# EAGLE design EZS (EAGLE 8.0.1)
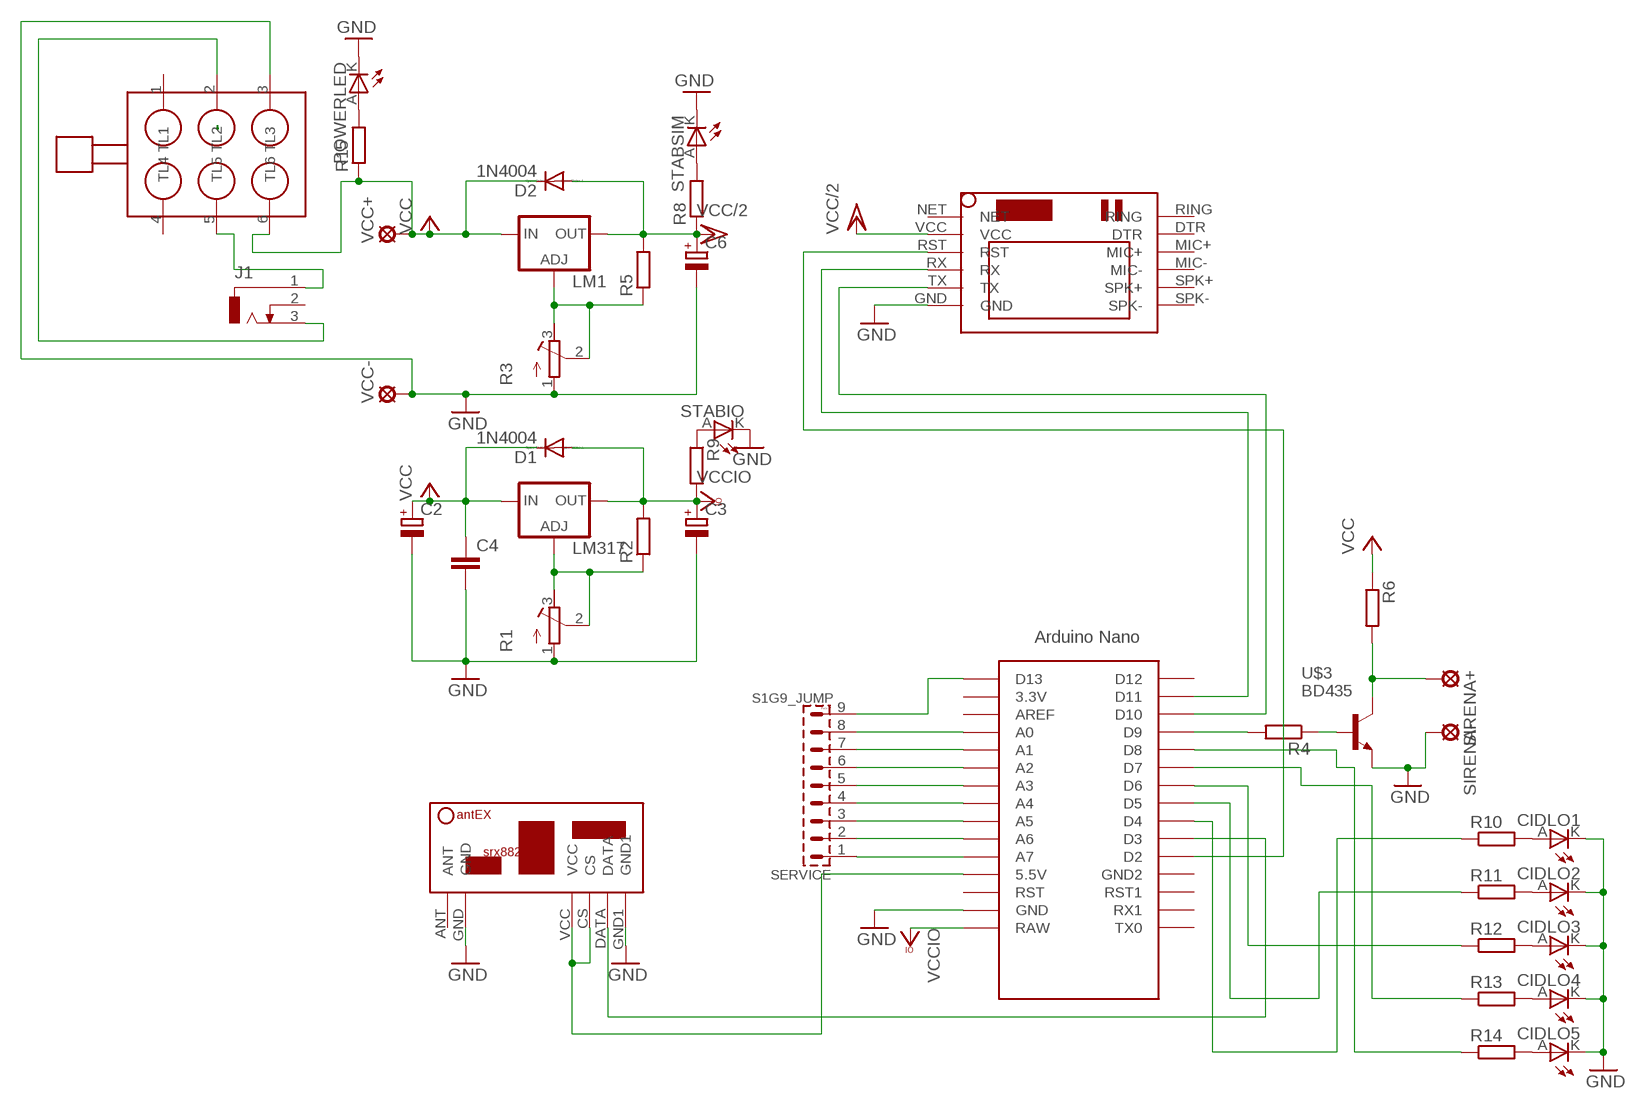
[diagram p0: schematic, sheet 1]

## Parts
C2  CPOL-EUE3.5-8  [E3,5-8]
C3  CPOL-EUE3.5-8  [E3,5-8]
C4  C-EU102-064X133  [C102-064X133]
C6  CPOL-EUE3.5-8  [E3,5-8]
CIDLO1  LEDLED3MM  [LED3MM]
CIDLO2  LEDLED3MM  [LED3MM]
CIDLO3  LEDLED3MM  [LED3MM]
CIDLO4  LEDLED3MM  [LED3MM]
CIDLO5  LEDLED3MM  [LED3MM]
D1  1N4004  [DO41-10]
D2  1N4004  [DO41-10]
J1  DCJ0303  [DCJ0303]
LM1  LM317TS  [317TS]
LM317  LM317TS  [317TS]
POWERLED  LEDLED3MM  [LED3MM]
R1  R-TRIMM64Y  [RTRIM64Y]
R2  R-EU_0207/10  [0207/10]
R3  R-TRIMM64Y  [RTRIM64Y]
R4  R-EU_0207/10  [0207/10]
R5  R-EU_0207/10  [0207/10]
R6  R-EU_0207/10  [0207/10]
R8  R-EU_0207/10  [0207/10]
R9  R-EU_0207/10  [0207/10]
R10  R-EU_0207/10  [0207/10]
R11  R-EU_0207/10  [0207/10]
R12  R-EU_0207/10  [0207/10]
R13  R-EU_0207/10  [0207/10]
R14  R-EU_0207/10  [0207/10]
R15  R-EU_0207/10  [0207/10]
SERVICE  S1G9_JUMP  [S1G9_JUM]
SIM800L  SIM800LMODULE  [SIM800LMODULE]
SIRENA+  LSP11  [LSP11]
SIRENA-  LSP11  [LSP11]
STABIO  LEDLED3MM  [LED3MM]
STABSIM  LEDLED3MM  [LED3MM]
U$1  NANO  [NANO]
U$2  RSX882  [SRX882]
U$3  BD435  [BD435]
U$4  TLACITKO  [TLACITKO]
VCC+  LSP11  [LSP11]
VCC-  LSP11  [LSP11]

## Nets
GND: C2.- C3.- C4.2 C6.- CIDLO1.K(C) CIDLO2.K(C) CIDLO3.K(C) CIDLO4.K(C) CIDLO5.K(C) POWERLED.K(C) R1.1(A) R3.1(A) SIM800L.GND SIRENA-.MP STABIO.K(C) STABSIM.K(C) U$1.GND U$2.GND U$2.GND1 U$3.E U$4.3(TL3) VCC-.MP
N$1: U$1.D3 U$2.DATA
N$2: LM317.1(ADJ) R1.2(S) R1.3(E) R2.1
N$3: U$1.5V(5.5V) U$2.CS U$2.VCC
N$4: R8.2 STABSIM.A
N$5: SIM800L.RX U$1.D11
N$6: LM1.1(ADJ) R3.2(S) R3.3(E) R5.1
N$7: SIM800L.TX U$1.D10
N$8: R4.2 U$1.D9
N$9: R4.1 U$3.B
N$10: R6.2 SIRENA+.MP U$3.C
N$11: J1.1 U$4.5(TL5)
N$12: J1.3 U$4.2(TL2)
N$13: POWERLED.A R15.2
N$15: SIM800L.RST U$1.D2
N$16: CIDLO1.A R10.2
N$17: CIDLO2.A R11.2
N$18: CIDLO3.A R12.2
N$19: CIDLO4.A R13.2
N$20: CIDLO5.A R14.2
N$21: R13.1 U$1.D7
N$22: R10.1 U$1.D4
N$24: R12.1 U$1.D6
N$25: SERVICE.1 U$1.A7
N$27: R9.1 STABIO.A
N$28: R11.1 U$1.D5
N$29: R14.1 U$1.D8
N$30: SERVICE.2 U$1.A6
N$31: SERVICE.3 U$1.A5
N$32: SERVICE.4 U$1.A4
N$33: SERVICE.5 U$1.A3
N$34: SERVICE.6 U$1.A2
N$35: SERVICE.7 U$1.A1
N$36: SERVICE.8 U$1.A0
N$37: SERVICE.9 U$1.D13
VCC: C2.+ C4.1 D1.C D2.C LM1.3(IN) LM317.3(IN) R6.1 R15.1 U$4.6(TL6) VCC+.MP
VCC/2: C6.+ D2.A LM1.2(OUT) R5.2 R8.1 SIM800L.VCC
VCCIO: C3.+ D1.A LM317.2(OUT) R2.2 R9.2 U$1.RAW
Unconnected: J1.2 SIM800L.DTR SIM800L.MIC+ SIM800L.MIC- SIM800L.NET SIM800L.RING SIM800L.SPK+ SIM800L.SPK- U$1.3.3V U$1.AREF U$1.D12 U$1.GND1(GND2) U$1.ICSP1 U$1.ICSP2 U$1.ICSP3 U$1.ICSP4 U$1.ICSP5 U$1.ICSP6 U$1.RST U$1.RST1 U$1.RX1 U$1.TX0 U$2.ANT U$4.1(TL1) U$4.4(TL4)

## Library data of the parts
C2 C3 C6 = rcl:CPOL-EU: POLARIZED CAPACITOR, European symbol
C4 = rcl:C-EU: CAPACITOR, European symbol
CIDLO1-CIDLO5 POWERLED STABIO STABSIM = #Led:LED
D1 D2 = diode:1N4004: DIODE general purpose rectifier, 1 A
J1 = con-jack:DCJ0303: DC POWER JACK Source: DCJ0303.pdf; OC_FARNELL: unknown; OC_NEWARK: unknown
LM1 LM317 = v-reg:LM317TS: VOLTAGE REGULATOR
R1 R3 = rcl:R-TRIMM: Trimm resistor
R2 R4-R6 R8-R15 = #Odpory:R-EU_: RESISTOR, European symbol
SERVICE = #PaJa_konektory:S1G9_JUMP: Radove konektory - koliky - 9x
SIM800L = SIM800LMODULE:SIM800LMODULE: SIM800L Module
SIRENA+ SIRENA- VCC+ VCC- = solpad:LSP11: SOLDER PAD drill 1.1 mm
U$1 = Arduino-clone:NANO: Arduino Nano
U$2 = SRX882:RSX882: SRX882 - přijímač 433MHz
U$3 = #BD435:BD435
U$4 = #Tlacitka:TLACITKO: Tlačítko ON/ON

## Board
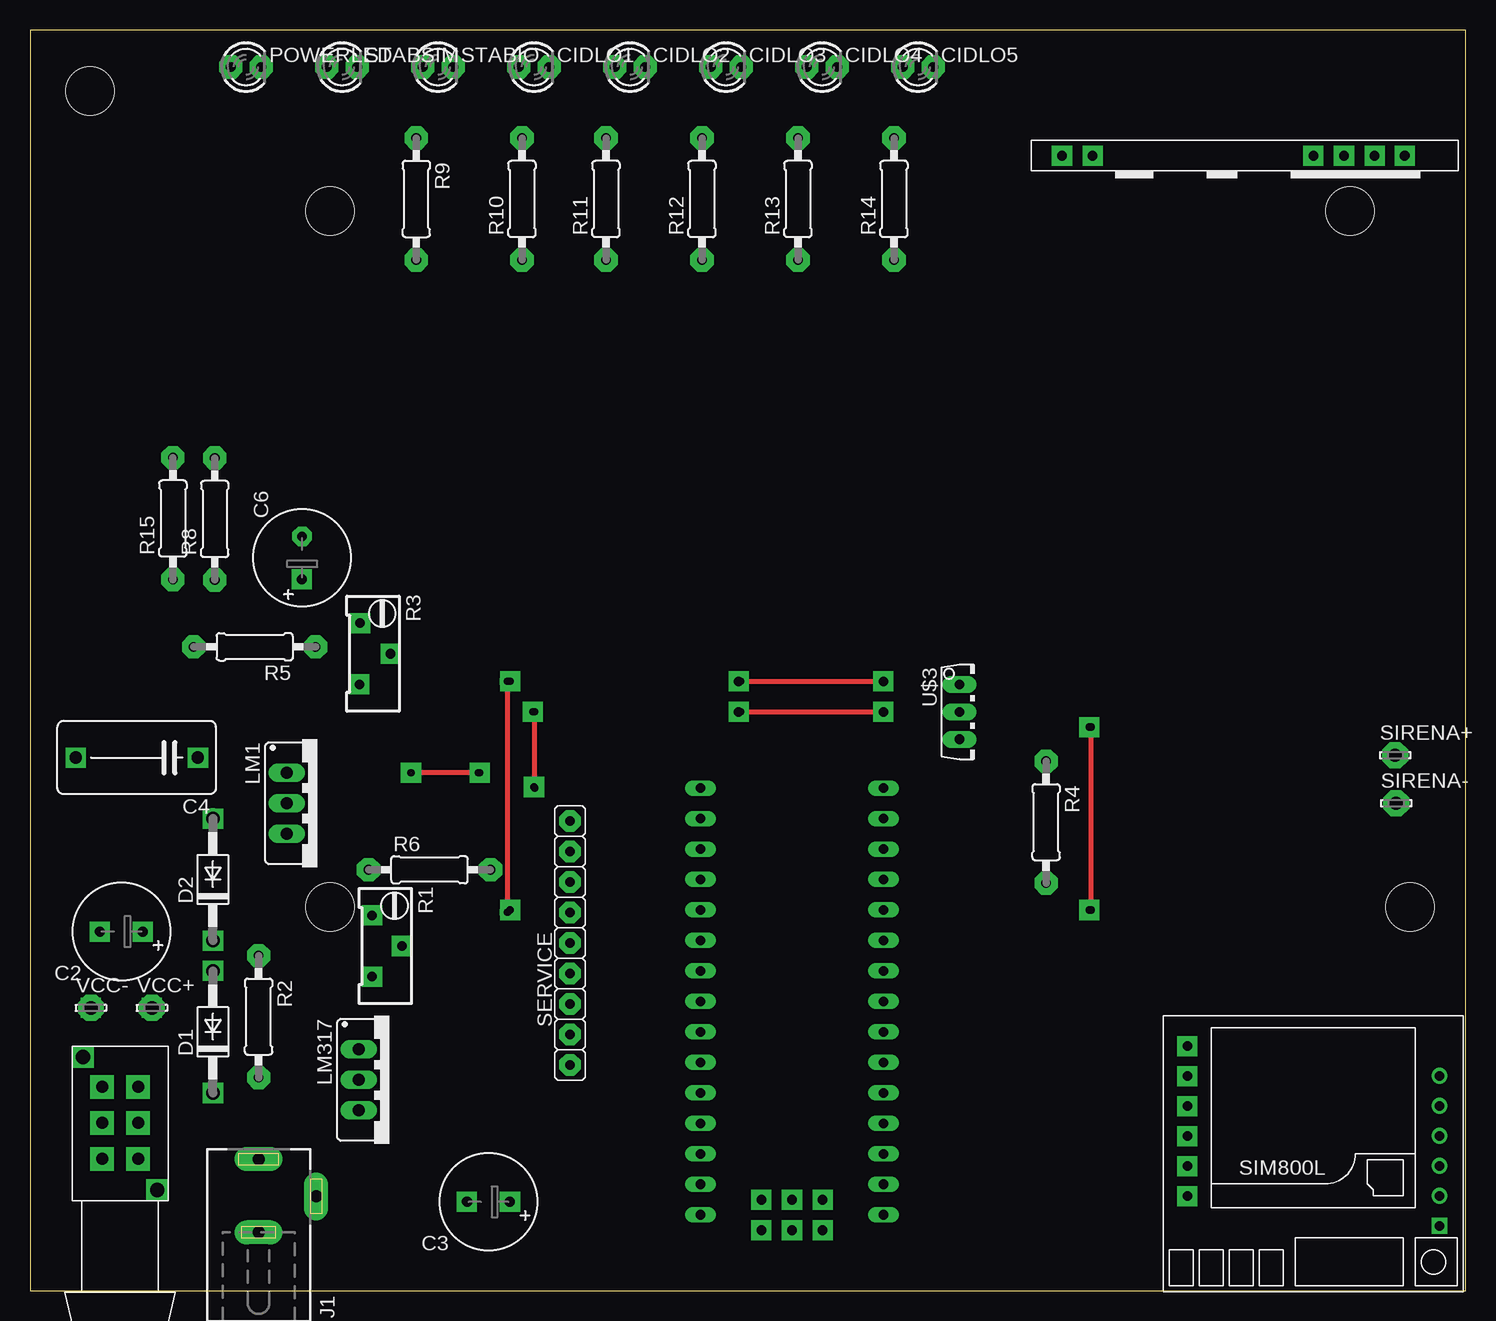
[diagram p1: board, top side]
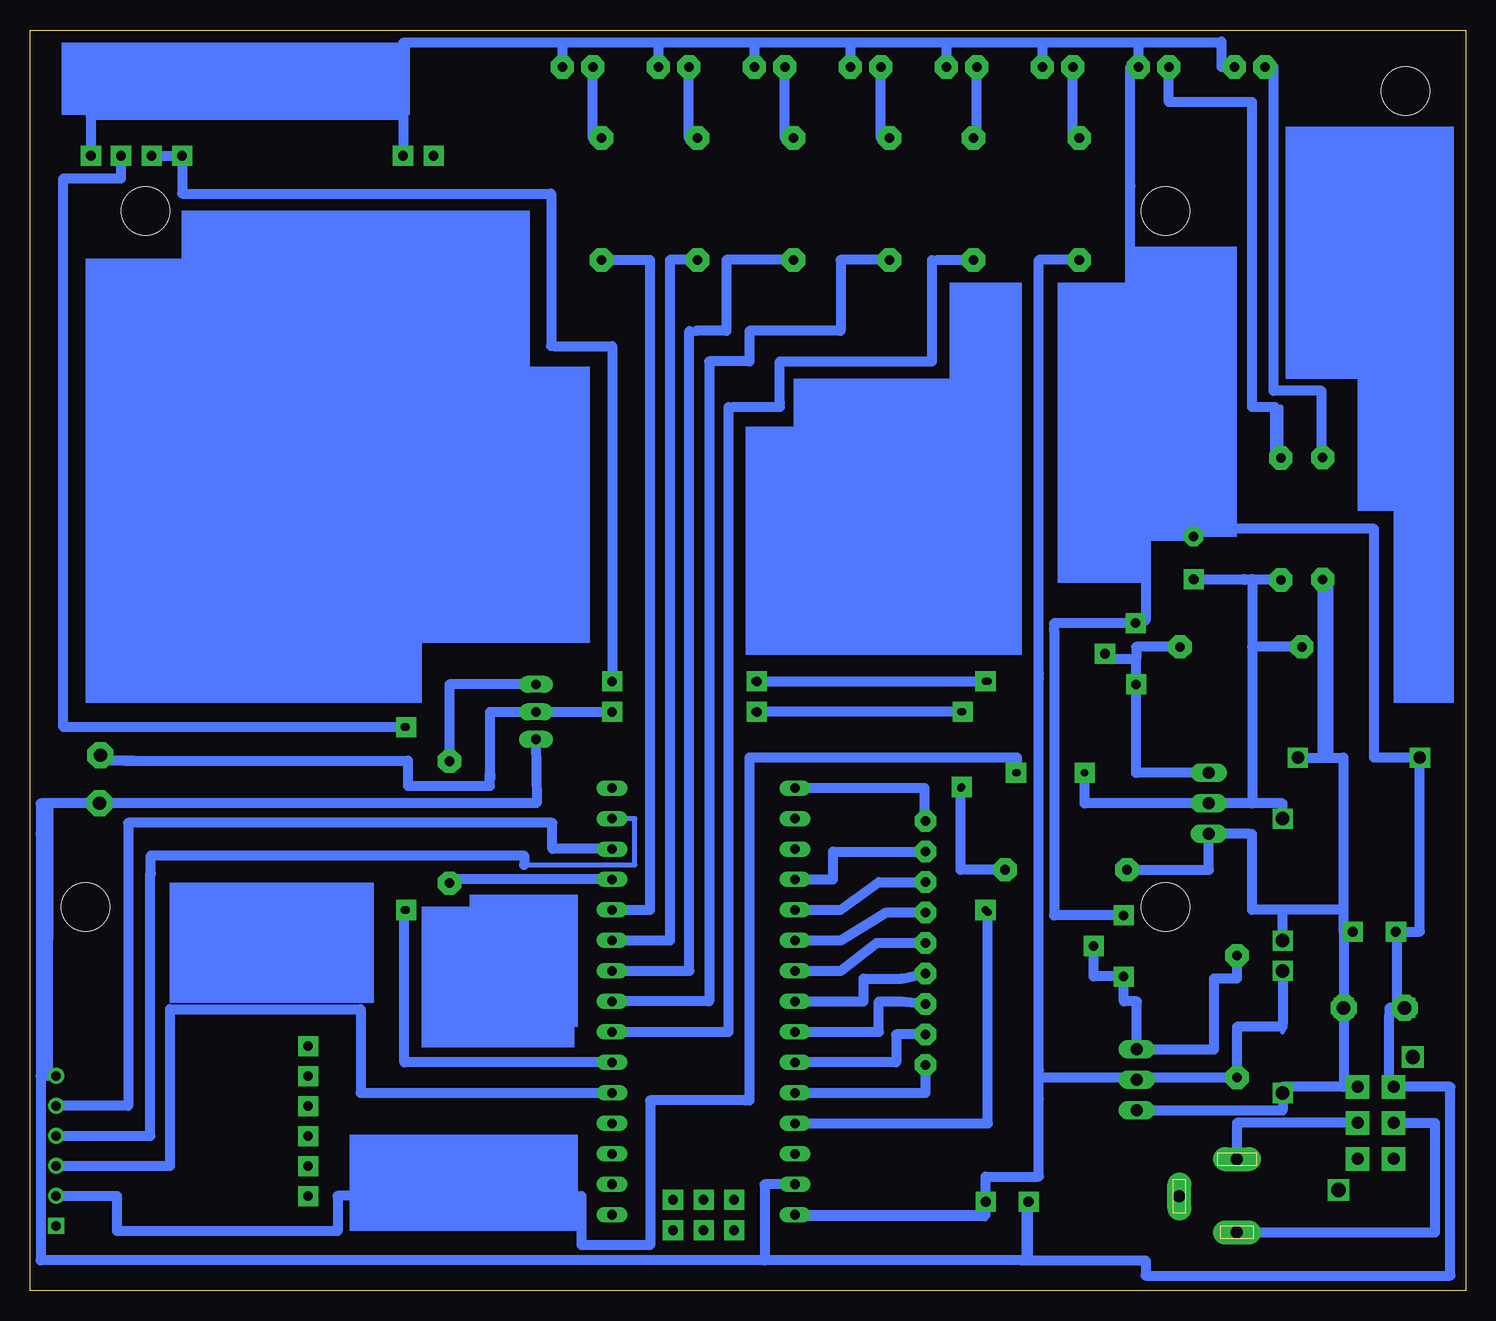
[diagram p2: board, bottom side, seen from below]

Size 119.63 x 105.08 mm. Coordinates in mm from the lower left corner, seen from the top.
Outline: 0,0 119.63,0 119.63,105.08 0,105.08 0,0
Copper layers (1*16): Top 0.035mm / dielectric 1.5mm / Bottom 0.035mm
Design rules "default": minimum track width 10mil, minimum drill 24mil, track to track 8mil, track to pad 8mil, pad to pad 8mil, via to via 8mil, smd to smd 8mil, copper to edge 40mil, drill to drill 8mil, minimum pad ring 10mil, minimum via ring 8mil, stop-mask expansion 4mil, vias tented up to drill 0mil, thermal gap 10mil
Holes 4 mm at 25,32 115,32 25,90 5,100 110,90

### Footprints (pad centres in the part's own frame; a part is rotated, then mirrored left to right if it is on the bottom)
E3,5-8 = drill 0.813 pad 1.6: + -1.778,0 | drill 0.813 pad 1.6 octagon: - 1.778,0
C102-064X133 = drill 1.016 octagon: 1 -5.08,0; 2 5.08,0
LED3MM = drill 0.8 pad 1.93 octagon: A -1.27,0; K 1.27,0
DO41-10 = drill 1.118: A 5.08,0; C -5.08,0
DCJ0303 = drill 1 pad 2 long: 1 0,3.1; 2 4.8,0; 3 0,-3
317TS = drill 1.016 long: 1 -2.54,-2.54; 2 0,-2.54; 3 2.54,-2.54
RTRIM64Y = drill 0.61: 1 0,-2.54; 2 -2.54,0; 3 0,2.54
0207/10 = drill 0.8 pad 1.93 octagon: 1 -5.08,0; 2 5.08,0
S1G9_JUM = drill 0.813 pad 1.778 octagon: 1 -10.16,0; 2 -7.62,0; 3 -5.08,0; 4 -2.54,0; 5 0,0; 6 2.54,0; 7 5.08,0; 8 7.62,0; 9 10.16,0
SIM800LMODULE = drill 0.8: DTR 10.5,1; GND -10.5,-6.5; MIC+ 10.5,-1.5; MIC- 10.5,-4; RST -10.5,1; RX -10.5,-1.5; SPK+ 10.5,-6.5; SPK- 10.5,-9; TX -10.5,-4; VCC -10.5,3.5 | drill 0.8 square: NET -10.5,6; RING 10.5,3.5
LSP11 = drill 1.118 pad 2.159 octagon: MP 0,0
NANO = drill 0.8 long: 3.3V -10.16,24.13; 5V -10.16,-1.27; A0 -10.16,19.05; A1 -10.16,16.51; A2 -10.16,13.97; A3 -10.16,11.43; A4 -10.16,8.89; A5 -10.16,6.35; A6 -10.16,3.81; A7 -10.16,1.27; AREF -10.16,21.59; D2 5.08,1.27; D3 5.08,3.81; D4 5.08,6.35; D5 5.08,8.89; D6 5.08,11.43; D7 5.08,13.97; D8 5.08,16.51; D9 5.08,19.05; D10 5.08,21.59; D11 5.08,24.13; D12 5.08,26.67; D13 -10.16,26.67; GND -10.16,-6.35; GND1 5.08,-1.27; RAW -10.16,-8.89; RST -10.16,-3.81; RST1 5.08,-3.81; RX1 5.08,-6.35; TX0 5.08,-8.89 | drill 0.8: ICSP1 -5.08,-10.16; ICSP2 -5.08,-7.62; ICSP3 -2.54,-10.16; ICSP4 -2.54,-7.62; ICSP5 0,-10.16; ICSP6 0,-7.62
SRX882 = drill 0.8 square: ANT 0,0; CS 23.495,0; DATA 26.035,0; GND 2.54,0; GND1 28.575,0; VCC 20.955,0
BD435 = drill 0.8 pad 1.422 long: B -2.286,0; C 0,0; E 2.286,0
TLACITKO = drill 1 pad 1.93 square: 1 0,0; 2 0,3; 3 0,6; 4 3,0; 5 3,3; 6 3,6 | drill 1.2 pad 1.676 square: NC -1.6,8.5; NO 4.6,-2.6

### Placement (x,y rotation side)
C2  7.62,29.94 180 top
C3  38.21,7.43 180 top
C4  8.89,44.45 180 top
C6  22.67,61.1 90 top
CIDLO1  42,102 0 top
CIDLO2  50,102 0 top
CIDLO3  58,102 0 top
CIDLO4  66,102 0 top
CIDLO5  74,102 0 top
D1  15.24,21.59 90 top
D2  15.24,34.29 90 top
J1  19.05,7.89 0 top
LM1  23.94,40.64 270 top
LM317  29.94,17.59 270 top
POWERLED  18,102 0 top
R1  28.48,28.75 180 top
R2  19.05,22.86 270 top
R3  27.46,53.1 180 top
R4  84.67,39.06 270 top
R5  18.72,53.68 180 top
R6  33.29,35.1 0 top
R8  15.39,64.33 90 top
R9  32.19,91 270 top
R10  41,91 90 top
R11  48,91 90 top
R12  56,91 90 top
R13  64,91 90 top
R14  72,91 90 top
R15  11.9,64.36 90 top
SERVICE  45,29 90 top
SIM800L  106.95,11.43 180 top
SIRENA+  113.76,44.64 0 top
SIRENA-  113.84,40.64 0 top
STABIO  34,102 0 top
STABSIM  26,102 0 top
U$1  66.04,15.24 0 top
U$2  86,94.61 0 top
U$3  77.47,48.26 270 top
U$4  6,11 0 top
VCC+  10.16,23.59 0 top
VCC-  5.08,23.59 0 top

### Tracks (layer width: path | path; a pad name or v marks a point on that pad's centre or on a via)
GND
  Bottom 0.406: 20.32,104.14 27.27,104.14 | 27.27,104.14 27.27,102.23 STABSIM.K 27.94,102 | 27.27,104.14 35.27,104.14 | 35.27,104.14 35.27,102.23 STABIO.K | 35.27,104.14 43.27,104.14 | CIDLO1.K 43.27,104.14 | 43.27,104.14 51.27,104.14 | 51.27,104.14 51.27,102.23 CIDLO2.K | 51.27,104.14 59.27,104.14 | 59.27,104.14 59.27,102.23 CIDLO3.K | 59.27,104.14 67.27,104.14 | CIDLO4.K 67.27,104.14 | 67.27,104.14 75.27,104.14 | 75.27,104.14 75.27,102.23 CIDLO5.K | 75.27,104.14 88.53,104.14 88.53,98 88.53,97.79 | C2.- 5.84,23.59 VCC-.MP 5.08,23.5 5.71,23.5 6.35,23.5 6.35,23 | 26.67,63.5 26.67,55.88 26.67,55.64 R3.1 27.46,55.88 34.29,55.88 34.29,55.24 34.29,55 | 26.67,63.5 22.67,63.5 | 27.94,92.08 27.94,63.5 26.67,63.5 | 36.83,2.54 37,2.54 58.42,2.54 | 36.83,2.54 26.67,2.54 | U$2.GND 88.53,97.79 | U$2.GND1 114.3,94.61 114.3,97.79 88.53,97.79 | C3.- 36.83,7.43 36.83,2.54 | 1.27,17 U$4.3 6.35,17
  Bottom 0.813: 118.75,17.93 118.75,2.54 37,2.54 36.43,2.54 | SIM800L.GND 118.75,17.93 | 118.75,38.1 118.75,17.93 | 118.75,38.1 118.06,40.65 | U$3.E 77.42,40.65 118.06,40.65 | U$1.GND 58.42,8.89 58.42,2.54 | 36.43,2.54 C3.- | 36.43,2.54 26.67,2.54 26.67,1.27 1.27,1.27 1.27,17 6.35,17 6.35,23 6.35,23.59 VCC-.MP | C6.- 22.67,63.5 7.62,63.5 7.62,44.45 C4.2 3.81,29.94 C2.- 5.71,29.94 5.71,23.5 | C6.- 26.67,62.88 26.67,55.88 | R3.1 34.29,55.64 34.29,55.24 | 34.29,55 34.29,31.29 R1.1 | C6.- 27.94,62.88 27.94,92.08 27.94,102 | POWERLED.K 20.32,102 20.32,104 | 20.32,104 20.32,104.14 | 20.32,104 27.27,104 | 27.27,104 27.27,102.23 | 27.27,104 35.27,104 | 35.27,104 35.27,102.23 | 35.27,104 43.27,104 | 43.27,104 CIDLO1.K | 43.27,104 51.27,104 | 51.27,104 51.27,102.23 | 51.27,104 59.27,104 | 59.27,104 59.27,102.23 | 59.27,104 67.27,104 | 67.27,104 CIDLO4.K | 67.27,104 75.27,104 | 75.27,104 75.27,102.23 | 75.27,104 88.53,104 88.53,98 | 88.53,98 U$2.GND | 88.53,98 114.57,98 U$2.GND1 | 118.11,17.93 118.06,40.65 | SIRENA-.MP 118.75,40.64 118.75,38.1
N$1  (via drill 0.6 pad 1.27)
  Top 0.406: v88.44,31.75 v88.44,46.99
  Bottom 0.406: U$1.D3 88.44,19.05 v88.44,31.75 | v88.44,46.99 116.84,46.99 116.84,92.71 112.03,92.71 U$2.DATA
  Bottom 0.813: U$1.D3 88.44,19.05 v88.44,31.75 | v88.44,46.99 116.84,46.99 116.84,92.71 112.03,92.71 U$2.DATA
N$2
  Bottom 0.406: R1.2 31.02,26.21 R1.3 28.48,24.13 27.4,24.13 LM317.1 20.95,20.13 20.95,26.04 19.05,26.04 R2.1
  Bottom 0.813: R2.1 19.05,26.04 20.95,26.04 20.95,20.13 LM317.1 27.4,24.13 28.48,24.13 R1.3 31.02,26.21 R1.2
N$3  (via drill 0.6 pad 1.27, 0.6 pad 1.68, 0.8 pad 1.68)
  Top 0.406: v39.8,31.56 v39.8,50.8 | v59.23,50.8 v71.12,50.8
  Bottom 0.406: 39.8,31.11 v39.8,31.56 | 76.2,78.74 76,78.74
  Bottom 0.813: U$2.CS U$2.VCC v106.95,94.6 106.95,91.44 76.2,91.44 76.2,78.74 | 76,78.74 71.12,78.74 v71.12,50.8 | v59.23,50.8 v59.05,50.8 v40.01,50.8 v39.8,50.8 | U$1.5V 39.8,13.97 39.8,31.11
N$4
  Bottom 0.406: STABSIM.A 24.73,101.6 24.73,99.06 18,99.06 17.78,99.06 17.78,73.66 15.88,73.66 15.39,73.66 R8.2
  Bottom 0.813: R8.2 15.88,69.41 15.88,73.66 17.78,73.66 17.78,99.06 | 18,99.06 24.73,99.06 24.73,101.6
N$5
  Bottom 0.406: U$1.D11 69.22,39.37 69.22,35.5 78.45,35.5
  Bottom 0.813: 78.45,35.5 78.45,36.3 109.55,36.3 109.55,34.8 109.6,34.8 109.6,12.93 SIM800L.RX
N$6
  Bottom 0.406: 27.46,43.18 R3.3 27.46,52.7
  Bottom 0.813: LM1.1 27.46,43.18 27.46,52.7 | R5.1 27.46,53.68 27.46,52.7 | R3.2 30,52.7 27.46,52.7
N$7
  Bottom 0.813: SIM800L.TX 111.45,15.43 111.45,39 76.1,39 76.1,36.85 71.12,36.85 U$1.D10
N$8
  Bottom 0.406: U$1.D9 84.67,34.29 R4.2
  Bottom 0.813: U$1.D9 84.67,34.29 R4.2
N$9
  Bottom 0.406: U$3.B 84.67,50.55 R4.1
  Bottom 0.813: U$3.B 84.67,50.55 R4.1
N$10  (via drill 0.6 pad 1.27, 0.8 pad 1.68)
  Top 0.406: v42.07,41.91 v42.07,48.26 | v59.23,48.26 v71.12,48.26
  Bottom 0.406: v71.12,48.26 U$3.C 81.28,48.26
  Bottom 0.813: 81.28,43.15 81.28,42.64 | 81.28,43.15 81.28,48.26 v71.12,48.26 | R6.2 42.07,35.1 v42.07,41.91 | v42.07,48.26 v59.05,48.26 v59.23,48.26 | 111.76,44.2 111,44.2 | 111,44.2 88.15,44.2 88.15,42.1 81.3,42.1 81.3,43.15 81.28,43.15 | 111,44.2 113.76,44.2 SIRENA+.MP
N$11
  Bottom 0.406: J1.1 19.05,13.97 9,13.97 U$4.5
  Bottom 0.813: U$4.5 19.05,14 J1.1
N$12
  Bottom 0.406: J1.3 2.54,4.89 2.54,14 U$4.2
  Bottom 0.813: J1.3 2.54,4.89 2.54,14 U$4.2
N$13
  Bottom 0.406: R15.2 12,69.44 12,75 16,75 16,102 POWERLED.A
  Bottom 0.813: R15.2 12,69.44 12,75 16,75 16,102 POWERLED.A
N$15
  Bottom 0.406: SIM800L.RST 107.95,10.43 107.95,23.5 92.08,23.5 92.08,16.51 92,16.51 U$1.D2
  Bottom 0.813: SIM800L.RST 107.95,10.43 107.95,23.5 92.08,23.5 92.08,16.51 | 92,16.51 U$1.D2
N$16
  Bottom 0.406: R10.2 40.73,96.08 40.73,101.6 CIDLO1.A
  Bottom 0.813: R10.2 40.73,96.08 40.73,101.6
N$17
  Bottom 0.406: R11.2 48.73,96.08 CIDLO2.A
  Bottom 0.813: R11.2 48.73,96.08 CIDLO2.A
N$18
  Bottom 0.406: R12.2 56.73,96.08 CIDLO3.A
  Bottom 0.813: R12.2 56.73,96.08 CIDLO3.A
N$19
  Bottom 0.406: R13.2 64.73,96.08 64.73,101.6 CIDLO4.A
  Bottom 0.813: R13.2 64.73,96.08 64.73,101.6
N$20
  Bottom 0.406: R14.2 72.73,96.08 CIDLO5.A
  Bottom 0.813: R14.2 72.73,96.08 CIDLO5.A
N$21
  Bottom 0.406: R13.1 66.31,85.92 66.31,71 66.31,29.21 U$1.D7
  Bottom 0.813: R13.1 66.31,85.92 66.31,71 66.31,29.21 U$1.D7
N$22
  Bottom 0.406: R10.1 44,85.92 44.45,85.92 44.45,77.47 57,77.47 57.15,77.47 57.15,74 57.15,73.66 61,73.66 61.41,73.66 61.41,73 61.41,21.59 U$1.D4
  Bottom 0.813: U$1.D4 61.41,21.59 61.41,73 61.41,73.66 | 57.15,73.66 61,73.66 | 57.15,74 57.15,77.47 | 57,77.47 44.45,77.47 44.45,85.92 | 44,85.92 R10.1
N$24
  Bottom 0.406: 64.67,80.01 64.14,80.01 62.23,80.01
  Bottom 0.813: 71,26.67 U$1.D6 64.67,26.67 64.67,80.01 | 64.14,80.01 61.59,80.01 61.59,85.92 R12.1
N$25
  Bottom 0.813: U$1.A7 45,16.51 SERVICE.1
N$26  (via drill 0.6 pad 1.27)
  other vias: 37.37,43.18
N$27
  Bottom 0.406: R9.1 32.73,96.08 32.73,101.6 STABIO.A
  Bottom 0.813: R9.1 32.73,96.08 32.73,101.6
N$28
  Bottom 0.406: R11.1 52.07,85.92 52.07,80.01 59.69,80.01 59.69,77.47 63.04,77.47 63.04,24.13 U$1.D5
  Bottom 0.813: R11.1 52.07,85.92 52.07,80.01 59.69,80.01 59.69,77.47 63.04,77.47 63.04,24.13 U$1.D5
N$29
  Bottom 0.406: R14.1 67.94,85.92 67.94,58 67.94,57.78 67.94,31.75 U$1.D8
  Bottom 0.813: U$1.D8 67.94,31.75 67.94,57.78 | 67.94,58 67.94,85.92 R14.1
N$30
  Bottom 0.813: U$1.A6 47.46,19.05 47.46,21.38 SERVICE.2
N$31
  Bottom 0.813: U$1.A5 48.9,21.59 48.9,24.13 47,24.13 SERVICE.3
N$32
  Bottom 0.813: U$1.A4 50.16,24.13 50.16,26.04 47,26.04 SERVICE.4
N$33
  Bottom 0.813: U$1.A3 52.07,26.67 49.07,29 SERVICE.5
N$34
  Bottom 0.813: U$1.A2 52.07,29.21 48.26,31.54 SERVICE.6
N$35
  Bottom 0.813: U$1.A1 52.07,31.75 48.9,34.08 SERVICE.7
N$36
  Bottom 0.813: U$1.A0 52.7,34.29 52.7,36.62 SERVICE.8
N$37
  Bottom 0.813: SERVICE.9 45.09,39.16 45.09,41.91 U$1.D13
N$38  (via drill 0.6 pad 1.68)
  other vias: 42,42
N$39  (via drill 0.6 pad 1.68)
  other vias: 41.91,48.26
N$40  (via drill 0.6 pad 1.68)
  other vias: 40.01,31.75
N$41  (via drill 0.6 pad 1.68)
  other vias: 37.47,43.18
N$42  (via drill 0.6 pad 1.68)
  other vias: 88.27,46.99
N$43  (via drill 0.6 pad 1.68)
  other vias: 88.27,31.75
N$44  (via drill 0.8 pad 1.68)
  other vias: 88.55,94.6
N$45  (via drill 0.8 pad 1.68)
  other vias: 86,94.6
N$46  (via drill 0.8 pad 1.68)
  other vias: 109.5,94.6
N$47  (via drill 0.8 pad 1.68)
  other vias: 112.05,94.6
N$48  (via drill 0.8 pad 1.68)
  other vias: 114.55,94.6
N$49  (via drill 0.8 pad 1.68)
  other vias: 28.5,31.3
N$50  (via drill 0.8 pad 1.68)
  other vias: 31,28.75
N$51  (via drill 0.8 pad 1.68)
  other vias: 28.5,26.2
N$52  (via drill 0.8 pad 1.68)
  other vias: 27.5,55.65
N$53  (via drill 0.8 pad 1.68)
  other vias: 27.45,50.55
N$54  (via drill 0.8 pad 1.68)
  other vias: 30.05,53.1
N$55  (via drill 0.8 pad 1.68)
  other vias: 36.4,7.45
N$56  (via drill 0.8 pad 1.68)
  other vias: 40,7.45
N$57  (via drill 0.8 pad 1.68)
  other vias: 3.8,44.45
N$58  (via drill 0.8 pad 1.68)
  other vias: 14,44.45
N$59  (via drill 0.8 pad 1.68)
  other vias: 15.25,39.35
N$60  (via drill 0.8 pad 1.68)
  other vias: 15.25,29.2
N$61  (via drill 0.8 pad 1.68)
  other vias: 15.25,26.7
N$62  (via drill 0.8 pad 1.68)
  other vias: 22.65,59.3
N$63  (via drill 0.8 pad 1.68)
  other vias: 9.4,29.95
N$64  (via drill 0.8 pad 1.68)
  other vias: 5.8,29.95
N$65  (via drill 0.8 pad 1.68)
  other vias: 5.05,23.6
N$66  (via drill 0.8 pad 1.68)
  other vias: 10.15,23.6
N$67  (via drill 0.8 pad 1.68)
  other vias: 15.25,16.5
N$68  (via drill 0.8 pad 1.68)
  other vias: 96.45,20.4
N$69  (via drill 0.8 pad 1.68)
  other vias: 96.45,17.9
N$70  (via drill 0.8 pad 1.68)
  other vias: 96.45,15.4
N$71  (via drill 0.8 pad 1.68)
  other vias: 96.45,12.9
N$72  (via drill 0.8 pad 1.68)
  other vias: 96.45,10.4
N$73  (via drill 0.8 pad 1.68)
  other vias: 96.45,7.9
N$74  (via drill 0.8 pad 1.68)
  other vias: 60.95,7.6
N$75  (via drill 0.8 pad 1.68)
  other vias: 63.5,7.6
N$76  (via drill 0.8 pad 1.68)
  other vias: 66.05,7.6
N$77  (via drill 0.8 pad 1.68)
  other vias: 60.95,5.05
N$78  (via drill 0.8 pad 1.68)
  other vias: 63.5,5.05
N$79  (via drill 0.8 pad 1.68)
  other vias: 66.05,5.05
VCC
  Bottom 0.406: 10.16,29.94 10.16,31.75 | 12.06,44.45 C4.1 | 11.43,44.45 12.06,44.45 | 10.16,44.45 10.16,31.75 | 10.16,31.75 15.24,31.75 17.78,31.75 | 15.24,15.05 D1.C 15.24,17.14 10.16,17.14 10.16,17 | 17.78,38.1 18,38.1 | R15.1 12.06,59.28 12.06,44.45
  Bottom 0.813: U$4.6 10.16,17 | 10.16,17 15.24,17 15.24,15.05 LM317.3 | 10.16,17 VCC+.MP 10.16,29.94 | R6.1 21.4,35.1 LM1.3 18,38.1 | D2.C 15.24,31.75 | C2.+ 10.16,29.94 | 10.16,29.94 10.16,44.45 11.43,44.45 | 11.43,44.45 C4.1 11.9,44.45 R15.1 11.43,59.28 11.43,44.45 | 10.16,31.75 17.78,31.75 17.78,38.1
VCC/2  (via drill 0.6 pad 1.27, 0.6 pad 1.68)  (1 unrouted)
  Top 0.406: v37.37,43.18 v31.75,43.18
  Bottom 0.406: 17.78,59.25 17.78,59.32 | 17.78,53.68 17.78,59.25 | 17.78,59.25 R8.1 | 31.75,40.64 LM1.2 17.78,40.64 | 73.66,7.93 74,7.93 | 59.69,15.88 60,15.88
  Bottom 0.813: D2.A 15.24,40.64 17.78,40.64 | 17.78,40.64 31.75,40.64 v31.75,43.18 | R5.2 17.78,53.68 | 17.78,53.68 17.78,40.64 | C6.+ 18.41,59.32 | 18.41,59.32 17.78,59.32 17.78,53.68 | R8.1 18.41,59.25 18.41,59.32 | v37.37,43.18 37.37,44.45 59.69,44.45 59.69,15.88 | 60,15.88 67.94,15.88 67.94,3.81 73.66,3.81 73.66,7.93 | 74,7.93 94,7.93 94,5 112.39,5 112.39,7.93 SIM800L.VCC
VCCIO
  Bottom 0.406: D1.A 15.24,22.23 15.24,22 | 15.24,22 15.24,21.59 | R9.2 35.56,85.92 35.56,51.44 35.56,51 35.56,22 | 35.56,22 35.56,21.59 | U$1.RAW 55.88,6 40,6 C3.+ 39.99,9.53 35.56,9.53 35.56,16 35.56,17.59 | 15.24,22 19.05,22 R2.2 19.05,17.59 LM317.2 35.56,17.59 | 35.56,17.59 35.56,18.41 35.56,22
  Bottom 0.813: U$1.RAW 39.99,6.35 39.99,9.53 35.56,9.53 35.56,16 | 35.56,16 35.56,17.59 | 35.56,18.41 35.56,17.78 R2.2 19.05,22 15.24,22 | D1.A 15.24,22.23 | 35.56,16 35.56,51 | 35.56,51 35.56,51.44 | 35.56,51 35.56,85.92 R9.2
(copper drawn outside any net)
  shapes: Bottom area x21